# EAGLE design Schematic (EAGLE 9.6.2)
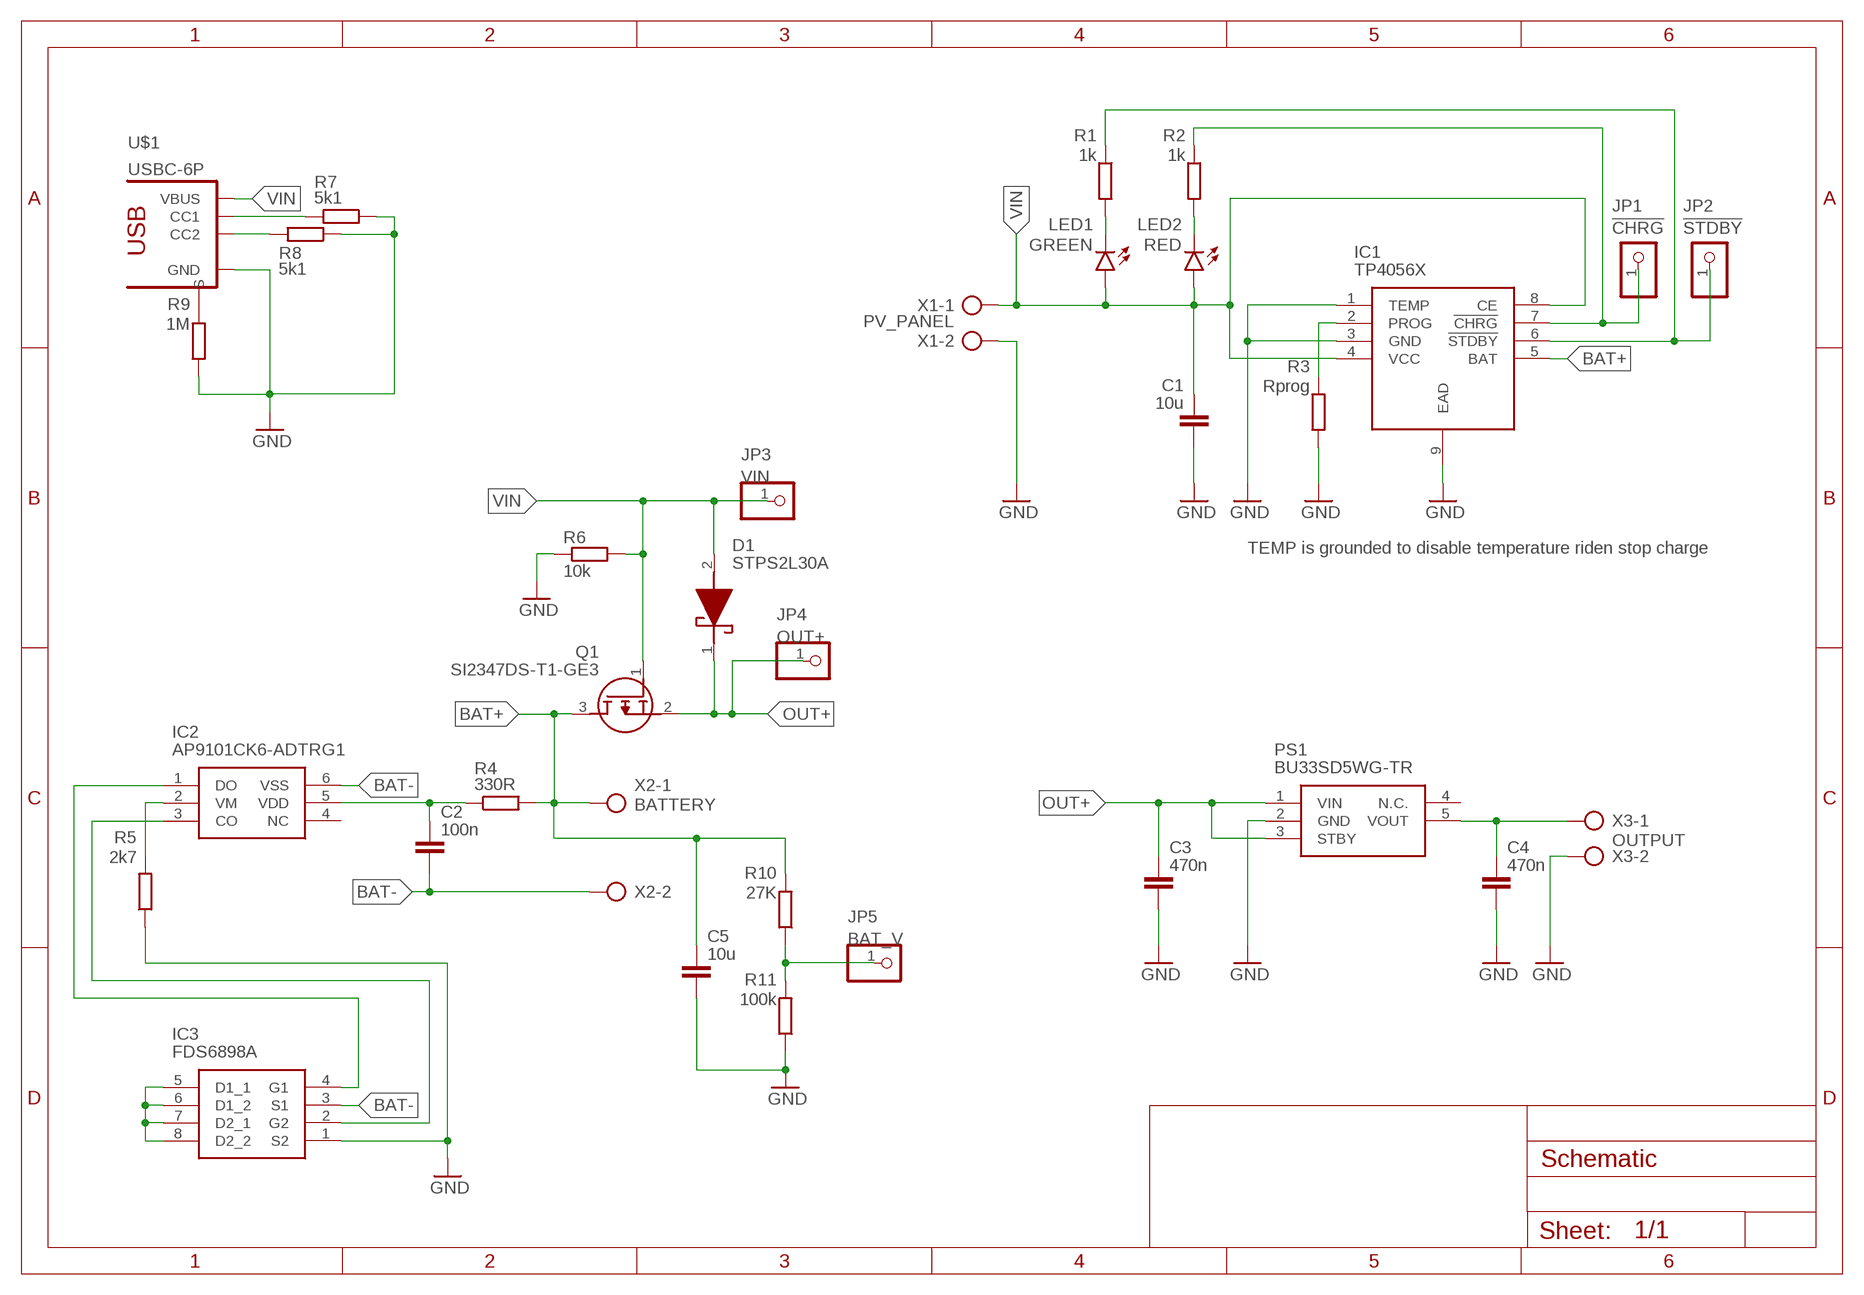
[diagram p0: schematic, sheet 1]

## Parts
C1  10u  C-EUC0805  [C0805]
C2  100n  C-EUC0805  [C0805]
C3  470n  C-EUC0805  [C0805]
C4  470n  C-EUC0805  [C0805]
C5  10u  C-EUC0805  [C0805]
D1  STPS2L30A  [DIOM5126X265N]
IC1  TP4056X  [SOIC127P600X175-9N]
IC2  AP9101CK6-ADTRG1  [SOT95P285X140-6N]
IC3  FDS6898A  [SOIC127P600X175-8N]
JP1  !CHRG  PINHD-1X1  [1X01]
JP2  !STDBY  PINHD-1X1  [1X01]
JP3  VIN  PINHD-1X1  [1X01]
JP4  OUT+  PINHD-1X1  [1X01]
JP5  BAT_V  PINHD-1X1  [1X01]
LED1  GREEN  LEDCHIPLED_0805  [CHIPLED_0805]
LED2  RED  LEDCHIPLED_0805  [CHIPLED_0805]
PS1  BU33SD5WG-TR  [SOT95P280X125-5N]
Q1  SI2347DS-T1-GE3  [SOT95P237X112-3N]
R1  1k  R-EU_R0805  [R0805]
R2  1k  R-EU_R0805  [R0805]
R3  Rprog  R-EU_R0805  [R0805]
R4  330R  R-EU_R0805  [R0805]
R5  2k7  R-EU_R0805  [R0805]
R6  10k  R-EU_R0805  [R0805]
R7  5k1  R-EU_R0805  [R0805]
R8  5k1  R-EU_R0805  [R0805]
R9  1M  R-EU_R0805  [R0805]
R10  27K  R-EU_R0805  [R0805]
R11  100k  R-EU_R0805  [R0805]
U$1  USBC-6P  [USCX-06FX-XXMX-01]
X1  PV_PANEL  AK300/2  [AK300/2]
X2  BATTERY  AK300/2  [AK300/2]
X3  OUTPUT  AK300/2  [AK300/2]

## Nets
BAT+: C5.1 IC1.5(BAT) Q1.3(D) R4.2 R10.2 X2.1
BAT-: C2.2 IC2.6(VSS) IC3.3(S1) X2.2
GND: C1.2 C3.2 C4.2 C5.2 IC1.1(TEMP) IC1.3(GND) IC1.9(EAD) IC3.1(S2) PS1.2(GND) R3.2 R5.1 R6.1 R7.1 R8.1 R9.2 R11.1 U$1.GND1(GND) U$1.GND2(GND) X1.2 X3.2
N$1: LED1.C R1.2
N$2: LED2.C R2.2
N$3: IC1.6(!STDBY) JP2.1 R1.1
N$4: IC1.2(PROG) R3.1
N$5: C2.1 IC2.5(VDD) R4.1
N$6: IC1.7(!CHRG) JP1.1 R2.1
N$7: R9.1 U$1.SHIELD1(S) U$1.SHIELD2(S) U$1.SHIELD3(S) U$1.SHIELD4(S)
N$8: R8.2 U$1.CC2
N$9: IC2.2(VM) R5.2
N$10: IC2.1(DO) IC3.4(G1)
N$11: R7.2 U$1.CC1
N$12: IC2.3(CO) IC3.2(G2)
N$13: IC3.5(D1_1) IC3.6(D1_2) IC3.7(D2_1) IC3.8(D2_2)
N$15: JP5.1 R10.1 R11.2
OUT+: C3.1 D1.1(K) JP4.1 PS1.1(VIN) PS1.3(STBY) Q1.2(S)
VIN: C1.1 D1.2(A) IC1.4(VCC) IC1.8(CE) JP3.1 LED1.A LED2.A Q1.1(G) R6.2 U$1.VBUS1(VBUS) U$1.VBUS2(VBUS) X1.1
VOUT: C4.1 PS1.5(VOUT) X3.1
Unconnected: IC2.4(NC) PS1.4(N.C.)

## Notes on the sheet
- TEMP is grounded to disable temperature riden stop charge

## Library data of the parts
C1-C5 = rcl:C-EU: CAPACITOR, European symbol; SPICEPREFIX: C
D1 = 1-component-search:STPS2L30A: STPS2L30A, Schottky Diode, 2A max, 30V, 2-Pin, SMA Source: Datasheet <http://www.st.com/web/en/resource/technical/document/datasheet/CD00001633.pdf>; ARROW_PART_NUMBER: STPS2L30A; ARROW_PRICE-STOCK: https://www.arrow.com/en/products/stps2l30a/stmicroelectronics?region=nac; DESCRIPTION: STPS2L30A, Schottky Diode, 2A max, 30V, 2-Pin, SMA; HEIGHT: 2.65mm; MANUFACTURER_NAME: STMicroelectronics; MANUFACTURER_PART_NUMBER: STPS2L30A; MOUSER_PART_NUMBER: 511-STPS2L30A; MOUSER_PRICE-STOCK: https://www.mouser.co.uk/ProductDetail/STMicroelectronics/STPS2L30A?qs=yAkVQ3mwCG0OEYUK4%252B3dww%3D%3D
IC1 = TP4056X:TP4056X: PMIC - Battery Management SOP-8_EP_150mil RoHS Source: Datasheet <https://datasheet.lcsc.com/szlcsc/Nanjing-Extension-Microelectronics-TP4056X_C191323.pdf>; DESCRIPTION: PMIC - Battery Management SOP-8_EP_150mil RoHS; HEIGHT: 1.75mm; MANUFACTURER_NAME: Nanjing Extension Microelectronics; MANUFACTURER_PART_NUMBER: TP4056X
IC2 = 1-component-search:AP9101CK6-ADTRG1: Battery Management Protect w/ Pwr Down 1-Cell LI 3.0uA 3.5V Source: Datasheet <https://www.diodes.com/assets/Datasheets/AP9101C.pdf>; ARROW_PART_NUMBER: AP9101CK6-ADTRG1; ARROW_PRICE-STOCK: https://www.arrow.com/en/products/ap9101ck6-adtrg1/diodes-incorporated?region=nac; DESCRIPTION: Battery Management Protect w/ Pwr Down 1-Cell LI 3.0uA 3.5V; HEIGHT: 1.4mm; MANUFACTURER_NAME: Diodes Inc.; MANUFACTURER_PART_NUMBER: AP9101CK6-ADTRG1; MOUSER_PART_NUMBER: 621-AP9101CK6-ADTRG1; MOUSER_PRICE-STOCK: https://www.mouser.co.uk/ProductDetail/Diodes-Incorporated/AP9101CK6-ADTRG1?qs=W66WzN12R3ZRpT78WZD49g%3D%3D
IC3 = 1-component-search:FDS6898A: ON SEMICONDUCTOR - FDS6898A. - MOSFET, DUAL, N, SMD, SO-8 Source: Datasheet <https://www.onsemi.com/pub/Collateral/FDS6898A-D.PDF>; ARROW_PART_NUMBER: FDS6898A; ARROW_PRICE-STOCK: https://www.arrow.com/en/products/fds6898a/on-semiconductor?region=nac; DESCRIPTION: ON SEMICONDUCTOR - FDS6898A. - MOSFET, DUAL, N, SMD, SO-8; HEIGHT: 1.75mm; MANUFACTURER_NAME: onsemi; MANUFACTURER_PART_NUMBER: FDS6898A; MOUSER_PART_NUMBER: 512-FDS6898A; MOUSER_PRICE-STOCK: https://www.mouser.co.uk/ProductDetail/ON-Semiconductor-Fairchild/FDS6898A?qs=rFoKx6q3%2F911Dc6GES2NNA%3D%3D
JP1 JP2 JP4 JP5 = pinhead:PINHD-1X1: PIN HEADER
JP3 = pinhead:PINHD-1X1: PIN HEADER; SPICEPREFIX: X
LED1 LED2 = led:LED: LED OSRAM: - CHIPLED LG R971, LG N971, LY N971, LG Q971, LY Q971, LO R971, LY R971 LH N974, LH R974 LS Q976, LO Q976, LY Q976 LO Q996 - Hyper CHIPLED LW Q18S LB Q993, LB Q99A, LB R99A - SideLED LS A670, LO A670, LY A670, LG A670, LP A670 LB A673, LV A673, LT A673, LW A673 LH A674 LY A675 LS A676, LA A676, LO A676, LY A676, LW A676 LS A679, LY A679, LG A679 - Hyper Micro SIDELED® LS Y876, LA Y876, LO Y876, LY Y876 LT Y87S - SmartLED LW L88C, LW L88S LB L89C, LB L89S, LG L890 LS L89K, LO L89K, LY L89K LS L896, LA L896, LO L896, LY L896 - TOPLED LS T670, LO T670, LY T670, LG T670, LP T670 LSG T670, LSP T670, LSY T670, LOP T670, LYG T670 LG T671, LOG T671, LSG T671 LB T673, LV T673, LT T673, LW T673 LH T674 LS T676, LA T676, LO T676, LY T676, LB T676, LH T676, LSB T676, LW T676 LB T67C, LV T67C, LT T67C, LS T67K, LO T67K, LY T67K, LW E67C LS E67B, LA E67B, LO E67B, LY E67B, LB E67C, LV E67C, LT E67C LW T67C LS T679, LY T679, LG T679 LS T770, LO T770, LY T770, LG T770, LP T770 LB T773, LV T773, LT T773, LW T773 LH T774 LS E675, LA E675, LY E675, LS T675 LS T776, LA T776, LO T776, LY T776, LB T776 LHGB T686 LT T68C, LB T68C - Hyper Mini TOPLED® LB M676 - Mini TOPLED Santana® LG M470 LS M47K, LO M47K, LY M47K Source: http://www.osram.convergy.de LUXEON: - LUMILED® LXK2-PW12-R00, LXK2-PW12-S00, LXK2-PW14-U00, LXK2-PW14-V00 LXK2-PM12-R00, LXK2-PM12-S00, LXK2-PM14-U00 LXK2-PE12-Q00, LXK2-PE12-R00, LXK2-PE12-S00, LXK2-PE14-T00, LXK2-PE14-U00 LXK2-PB12-K00, LXK2-PB12-L00, LXK2-PB12-M00, LXK2-PB14-N00, LXK2-PB14-P00, LXK2-PB14-Q00 LXK2-PR12-L00, LXK2-PR12-M00, LXK2-PR14-Q00, LXK2-PR14-R00 LXK2-PD12-Q00, LXK2-PD12-R00, LXK2-PD12-S00 LXK2-PH12-R00, LXK2-PH12-S00 LXK2-PL12-P00, LXK2-PL12-Q00, LXK2-PL12-R00 Source: www.luxeon.com KINGBRIGHT: KA-3528ASYC Source: www.kingbright.com
PS1 = 1-component-search:BU33SD5WG-TR: LDO regulator,3.3V,0.5A,standby,SSOP5 ROHM BU33SD5WG-TR, LDO Voltage Regulator, 0.5A, 3.3 V +/-2%, 1.7 6 Vin, 5-Pin SSOP Source: Datasheet <https://componentsearchengine.com/Datasheets/1/BU33SD5WG-TR.pdf>; DESCRIPTION: LDO regulator,3.3V,0.5A,standby,SSOP5 ROHM BU33SD5WG-TR, LDO Voltage Regulator, 0.5A, 3.3 V +/-2%, 1.7 6 Vin, 5-Pin SSOP; HEIGHT: 1.25mm; MANUFACTURER_NAME: ROHM Semiconductor; MANUFACTURER_PART_NUMBER: BU33SD5WG-TR; MOUSER_PART_NUMBER: 755-BU33SD5WG-TR; MOUSER_PRICE-STOCK: https://www.mouser.co.uk/ProductDetail/ROHM-Semiconductor/BU33SD5WG-TR?qs=%2FKR40Cd6GUrQDzRkUEt69Q%3D%3D
Q1 = 1-component-search:SI2347DS-T1-GE3: P-Ch MOSFET SOT-23 copper 30V 42mohm @ 1 Source: Datasheet <https://www.vishay.com/docs/62827/si2347ds.pdf>; ARROW_PART_NUMBER: SI2347DS-T1-GE3; ARROW_PRICE-STOCK: https://www.arrow.com/en/products/si2347ds-t1-ge3/vishay?region=nac; DESCRIPTION: P-Ch MOSFET SOT-23 copper 30V 42mohm @ 1; HEIGHT: 1.12mm; MANUFACTURER_NAME: Vishay; MANUFACTURER_PART_NUMBER: Si2347DS-T1-GE3; MOUSER_PART_NUMBER: 78-SI2347DS-T1-GE3; MOUSER_PRICE-STOCK: https://www.mouser.co.uk/ProductDetail/Vishay-Semiconductors/SI2347DS-T1-GE3?qs=wnm%2FPMJNddFQv4lfacOrcA%3D%3D
R1-R11 = rcl:R-EU_: RESISTOR, European symbol; SPICEPREFIX: R
U$1 = USBC6P:USBC-6P: AliExpress Special! Connect 5.1k 10% resistors to each CC pin, pulled up to 3.3v or 5.0v.
X1-X3 = con-ptr500:AK300/2: CONNECTOR; OC_FARNELL: unknown; OC_NEWARK: unknown

## Board
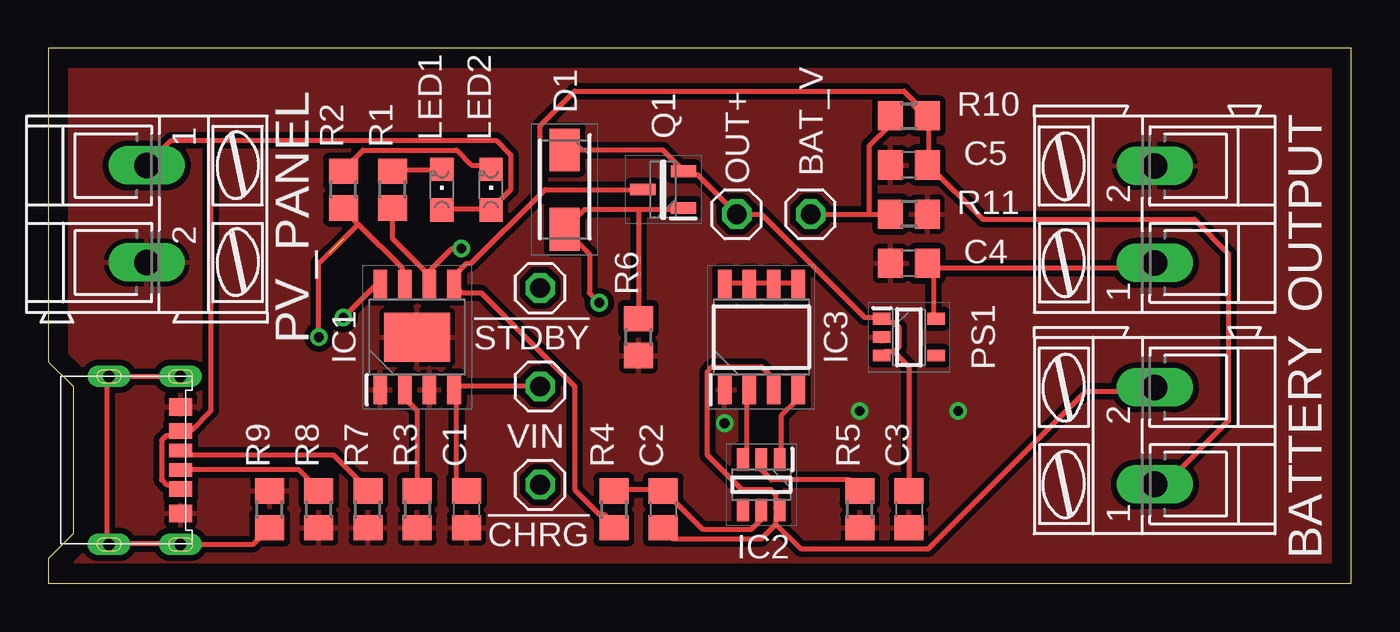
[diagram p1: board, top side]
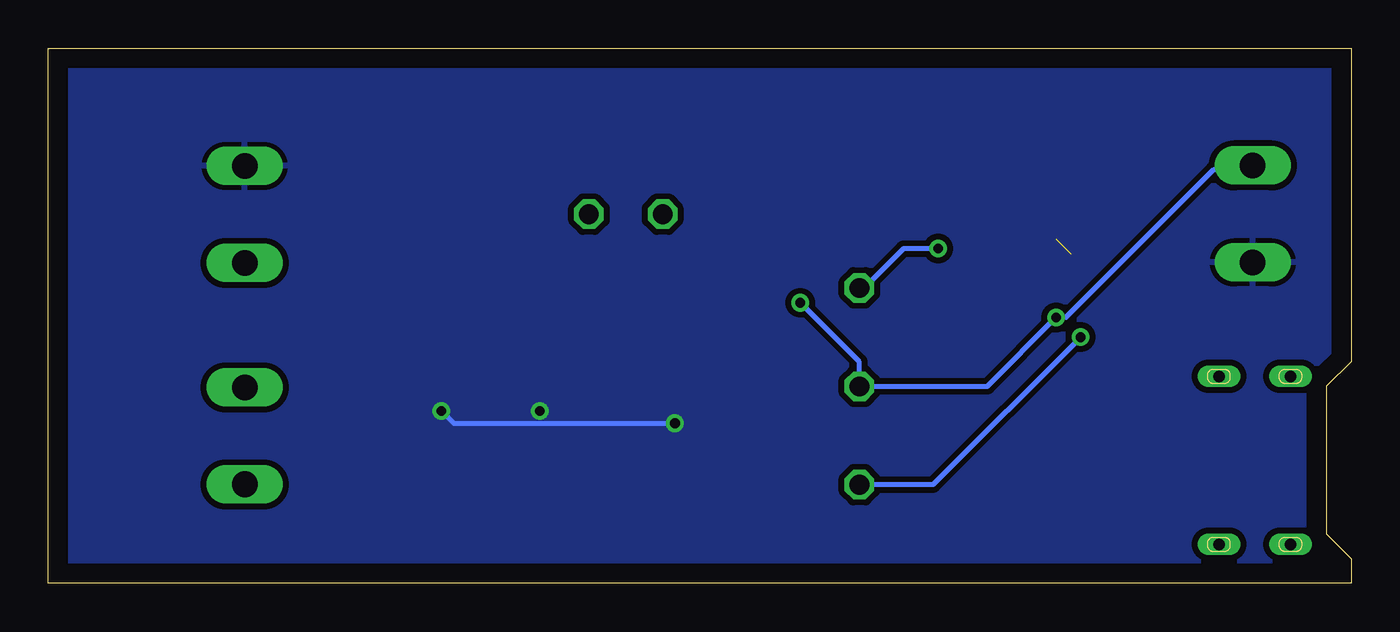
[diagram p2: board, bottom side, seen from below]

Size 67.29 x 27.61 mm. Coordinates in mm from the lower left corner, seen from the top.
Outline: 0,0 67.29,0 67.29,27.61 0,27.61 0,11.43 1.27,10.16 1.27,2.54 0,1.27 0,0
Copper layers (1*16): Top 0.035mm / dielectric 1.5mm / Bottom 0.035mm
Design rules "default *": minimum track width 10mil, minimum drill 0.35mm, track to track 10mil, track to pad 10mil, pad to pad 10mil, via to via 10mil, smd to smd 10mil, copper to edge 40mil, drill to drill 6mil, minimum pad ring 10mil, minimum via ring 8mil, stop-mask expansion 4mil, vias tented up to drill 0mil, thermal gap 10mil

### Footprints (pad centres in the part's own frame; a part is rotated, then mirrored left to right if it is on the bottom)
C0805 = smd 1.3 x 1.5: 1 -0.95,0; 2 0.95,0
DIOM5126X265N = smd 2.2 x 1.55: 1 -2.05,0; 2 2.05,0
SOIC127P600X175-9N = smd 1.525 x 0.7: 1 -2.712,1.905; 2 -2.712,0.635; 3 -2.712,-0.635; 4 -2.712,-1.905; 5 2.712,-1.905; 6 2.712,-0.635; 7 2.712,0.635; 8 2.712,1.905 | smd 2.513 x 3.402: 9 0,0
SOT95P285X140-6N = smd 1.15 x 0.6: 1 -1.3,0.95; 2 -1.3,0; 3 -1.3,-0.95; 4 1.3,-0.95; 5 1.3,0; 6 1.3,0.95
SOIC127P600X175-8N = smd 1.525 x 0.7: 1 -2.712,1.905; 2 -2.712,0.635; 3 -2.712,-0.635; 4 -2.712,-1.905; 5 2.712,-1.905; 6 2.712,-0.635; 7 2.712,0.635; 8 2.712,1.905
1X01 = drill 1.016 octagon: 1 0,0
CHIPLED_0805 = smd 1.2 x 1.2: A 0,-1.05; C 0,1.05
SOT95P280X125-5N = smd 0.9 x 0.6: 1 -1.4,0.95; 2 -1.4,0; 3 -1.4,-0.95; 4 1.4,-0.95; 5 1.4,0.95
SOT95P237X112-3N = smd 1.3 x 0.6: 1 -1.05,0.95; 2 -1.05,-0.95; 3 1.05,0
R0805 = smd 1.3 x 1.5: 1 -0.95,0; 2 0.95,0
USCX-06FX-XXMX-01 = smd 0.7 x 1.2: CC1 0.5,-1.75; CC2 -0.5,-1.75 | smd 0.9 x 1.2: GND1 2.75,-1.75; GND2 -2.75,-1.75 | drill 0.6 long: SHIELD1 4.325,1.95; SHIELD2 4.325,-1.75; SHIELD3 -4.35,-1.75; SHIELD4 -4.35,1.95 | smd 0.8 x 1.2: VBUS1 1.5,-1.75; VBUS2 -1.5,-1.75
AK300/2 = drill 1.321 long: 1 -2.515,0; 2 2.489,0

### Placement (x,y rotation side)
C1  21.59,3.81 270 top
C2  31.75,3.81 270 top
C3  44.45,3.81 270 top
C4  44.45,16.51 180 top
C5  44.45,21.59 180 top
D1  26.67,20.32 270 top
IC1  19.05,12.7 90 top
IC2  36.83,5.08 270 top
IC3  36.83,12.7 90 top
JP1  25.4,5.08 90 top
JP2  25.4,15.24 90 top
JP3  25.4,10.16 90 top
JP4  35.56,19.05 180 top
JP5  39.37,19.05 180 top
LED1  20.32,20.32 0 top
LED2  22.86,20.32 0 top
PS1  44.45,12.7 0 top
Q1  31.75,20.32 180 top
R1  17.78,20.32 90 top
R2  15.24,20.32 90 top
R3  19.05,3.81 270 top
R4  29.21,3.81 270 top
R5  41.91,3.81 90 top
R6  30.48,12.7 90 top
R7  16.51,3.81 90 top
R8  13.97,3.81 90 top
R9  11.43,3.81 90 top
R10  44.45,24.13 0 top
R11  44.45,19.05 180 top
U$1  5.08,6.35 90 top
X1  5.08,19.05 270 top
X2  57.15,7.62 90 top
X3  57.15,19.05 90 top

### Tracks (layer width: path | path; a pad name or v marks a point on that pad's centre or on a via)
BAT+
  Top 0.254: 45.47,21.59 45.47,24.13 R10.2 45.21,24.13 44.7,24.64 44.7,24.89 44.2,25.4 27.18,25.4 25.4,23.62 25.4,20.07 | Q1.3 25.65,20.32 25.4,20.07 | 25.4,20.07 21.84,16.51 21.59,16.51 21.08,16 21.08,15.49 IC1.5 21.08,15.24 21.34,14.99 22.35,14.99 27.18,10.16 27.18,4.83 28.45,3.56 28.7,3.56 29.21,3.05 R4.2 | X2.1 57.68,5.11 60.96,8.38 60.96,17.02 59.18,18.8 48.26,18.8 45.47,21.59 | 45.47,21.59 C5.1
BAT-
  Top 0.254: 37.59,3.05 37.59,3.56 IC2.6 37.59,3.81 37.59,4.57 37.34,4.83 35.81,4.83 34.04,6.6 34.04,10.92 34.29,11.18 36.83,11.18 37.34,10.67 37.34,10.16 IC3.3 | 37.59,3.05 36.83,2.29 32.26,2.29 31.75,2.79 C2.2 | 37.59,3.05 38.86,1.78 45.47,1.78 53.59,9.91 57.15,9.91 X2.2
GND  (via drill 0.5)
  Bottom 0.254: v46.99,8.89 46.35,8.26 v34.92,8.26
  other vias: 41.91,8.89
  pour Bottom (isolate 0.305): 0,0 0,1.27 1.27,2.54 1.27,10.16 0,11.43 0,27.94 67.31,27.94 67.31,0
  pour Top (isolate 0.305): 0,0 0,1.27 1.27,2.54 1.27,10.16 0,11.43 0,27.94 67.31,27.94 67.31,0
N$1
  Top 0.254: LED1.C 20.32,21.34 17.78,21.34 R1.2
N$2
  Top 0.254: LED2.C 22.86,21.59 21.84,21.59 21.08,22.35 16.26,22.35 15.24,21.34 R2.2
N$3  (via drill 0.5)
  Top 0.254: R1.1 17.78,17.78 19.56,16 | 19.56,16 19.56,15.49 IC1.6 19.56,16 | v21.34,17.27 20.83,17.27 19.56,16
  Bottom 0.254: JP2.1 25.15,15.24 23.11,17.27 v21.34,17.27
N$4
  Top 0.254: R3.1 19.05,8.89 18.54,9.4 18.54,9.91 IC1.2
N$5
  Top 0.254: IC2.5 36.83,3.3 36.32,2.79 33.78,2.79 31.75,4.83 | 31.75,4.83 29.21,4.83 R4.1 | 31.75,4.83 C2.1
N$6  (via drill 0.5)  (1 unrouted)
  Top 0.254: 16,18.54 18.29,16.26 18.29,15.49 IC1.7 | 16,18.54 15.24,19.3 R2.1 | 16,18.54 14.48,17.02 | v13.97,12.7 13.97,16.51 15.24,17.78
  Bottom 0.254: v13.97,12.7 21.59,5.08 JP1.1
N$7
  Top 0.254: U$1.SHIELD2 6.6,10.67 3.3,10.67 U$1.SHIELD1 3.05,10.67 3.05,2.03 U$1.SHIELD4 3.3,2.03 6.6,2.03 U$1.SHIELD3 | 6.86,2.03 U$1.SHIELD3 | U$1.SHIELD3 10.57,2 R9.1
N$8
  Top 0.254: U$1.CC2 6.86,5.84 12.95,5.84 13.97,4.83 R8.2
N$9
  Top 0.254: IC2.2 36.83,5.84 37.34,5.33 41.4,5.33 41.91,4.83 R5.2
N$10
  Top 0.254: IC2.1 37.85,6.6 37.85,8.64 38.61,9.4 38.61,9.91 IC3.4
N$11
  Top 0.254: U$1.CC1 6.86,6.6 14.73,6.6 16.51,4.83 R7.2
N$12
  Top 0.254: IC2.3 36.07,6.6 36.07,9.91 IC3.2
N$13
  Top 0.254: IC3.8 35.05,15.49 36.07,15.49 IC3.7 36.32,15.49 37.34,15.49 IC3.6 37.59,15.49 38.61,15.49 IC3.5
N$15
  Top 0.254: JP5.1 42.42,19.05 | 42.42,19.05 R11.2 | 42.42,19.05 42.42,22.61 43.43,23.62 43.43,24.13 R10.1
OUT+
  Top 0.254: 43.69,11.94 43.18,11.94 PS1.3 | 43.69,11.94 43.94,12.19 43.94,13.21 43.69,13.46 43.18,13.46 PS1.1 42.93,13.72 42.16,13.72 36.83,19.05 JP4.1 33.53,21.08 33.02,21.08 Q1.2 32.77,21.34 31.75,22.35 26.67,22.35 D1.1 | C3.1 44.45,11.18 43.69,11.94
VIN  (via drill 0.5)
  Top 0.254: 30.48,19.3 27.69,19.3 26.67,18.29 D1.2 27.94,17 27.94,14.99 v28.45,14.48 | 30.48,19.3 32.77,19.3 Q1.1 | 30.48,19.3 R6.2 | JP3.1 21.08,10.16 21.08,9.91 | 21.08,9.91 21.08,9.65 21.08,5.33 21.59,4.83 C1.1 | 21.08,9.91 IC1.4 | IC1.8 16.94,15.41 v15.24,13.72 | U$1.VBUS2 6.6,5.08 6.1,5.08 5.84,5.33 5.84,7.37 6.1,7.62 6.6,7.62 U$1.VBUS1 6.86,7.87 7.37,7.87 8.38,8.89 8.38,22.86 | 22.86,19.3 20.32,19.3 LED1.A | 22.86,19.3 23.88,20.32 23.88,22.1 23.11,22.86 8.38,22.86 | 8.38,22.86 6.35,22.86 5.08,21.59 X1.1 | 22.86,19.3 LED2.A
  Bottom 0.254: X1.1 5.08,21.34 7.11,21.34 14.73,13.72 v15.24,13.72 18.8,10.16 JP3.1 25.4,11.43 v28.45,14.48
VOUT
  Top 0.254: 45.72,16.26 45.72,13.72 PS1.5 | 45.72,16.26 45.47,16.51 C4.1 45.72,16.26 | 45.72,16.26 56.9,16.26 57.15,16.51 X3.1